# Altium schematic sheet power.SchDoc
size A4
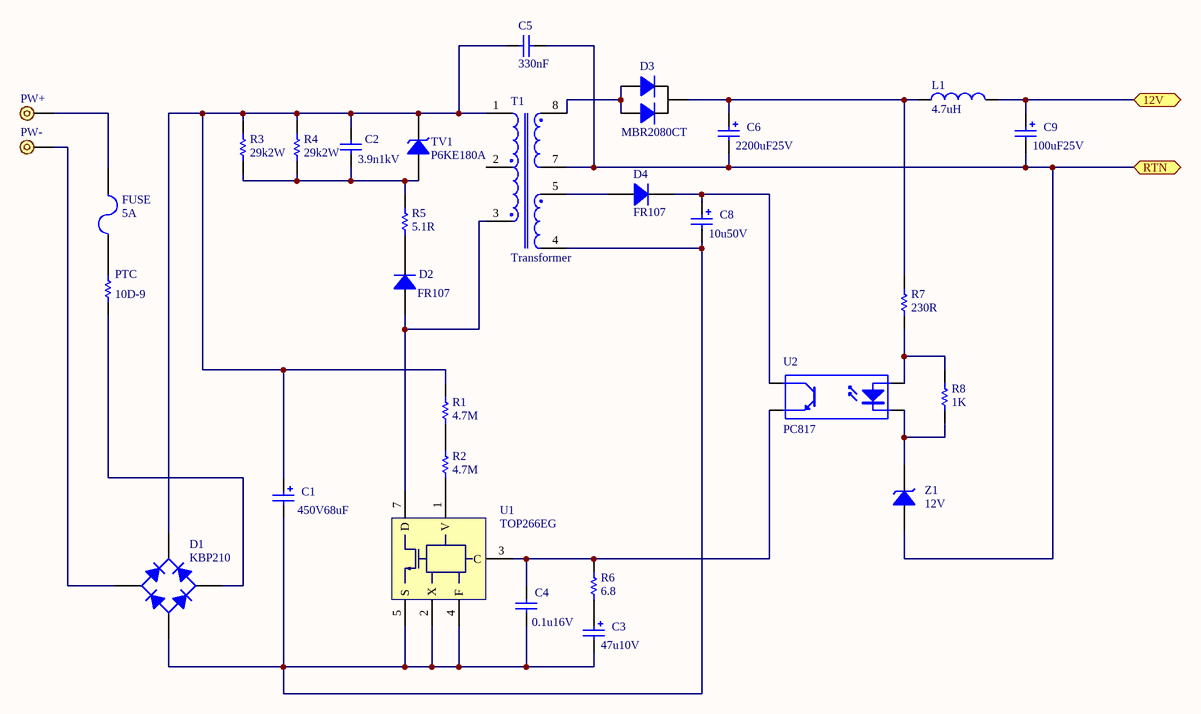
[diagram p0: power.SchDoc]

## Parts
C1  450V68uF  [CAP_18x30]
C2  3.9n1kV  [CAP7]
C3  47u10V  [CAP3]
C4  0.1u16V  [CAP6]
C5  330nF  [CAP_MKP]
C6  2200uF25V  [CAP_18x30]
C8  10u50V  [CAP3]
C9  100uF25V  [CAP3]
D1  KBP210  [KBP310]
D2  FR107  [DIO1]
D3  MBR2080CT  [TO247_TO220_SINK]
D4  FR107  [DIO1]
FUSE  5A  [FUSE5X20]
L1  4.7uH  [CHOKE]
PTC  10D-9  [PTC]
PW+  (no value)  [PAD1]
PW-  (no value)  [PAD1]
R1  4.7M  [RES0.25W]
R2  4.7M  [RES0.25W]
R3  29k2W  [RES2W_H]
R4  29k2W  [RES2W_H]
R5  5.1R  [RES0.25W]
R6  6.8  [RES0.25W]
R7  230R  [RES0.25W]
R8  1K  [RES0.25W]
T1  Transformer  [EER28]
TV1  P6KE180A  [DIO1]
U1  TOP266EG  [eSIP_SINK]
U2  PC817  [DIP-4]
Z1  12V  [DIO2]

## Ports
12V, RTN

## Nets
12V: C9.1 L1.2 ; port 12V
RTN: C5.2 C6.2 C9.2 T1.7 Z1.1(A) ; port RTN
NetC1_1: C1.1 C2.1 C5.1 D1.1(K) R1.2 R3.2 R4.2 T1.1 TV1.2(K)
NetC1_2: C1.2 C3.2 C4.2 C8.2 D1.4(A) T1.4 U1.2(X) U1.4(F) U1.5(S)
NetC2_2: C2.2 R3.1 R4.1 R5.2 TV1.1(A)
NetC3_1: C3.1 R6.1
NetC4_1: C4.1 R6.2 U1.3(C) U2.3(E)
NetC6_1: C6.1 D3.2(K) L1.1 R7.2
NetC8_1: C8.1 D4.2(K) U2.4(C)
NetD1_2: D1.2(C) PTC.2
NetD1_3: D1.3(C) PW-.1
NetD2_1: D2.1(A) T1.3 U1.7(D)
NetD2_2: D2.2(K) R5.1
NetD3_1: D3.1(A) D3.3(A) T1.8
NetD4_1: D4.1(A) T1.5
NetFUSE_1: FUSE.1 PW+.1
NetFUSE_2: FUSE.2 PTC.1
NetR1_1: R1.1 R2.2
NetR2_1: R2.1 U1.1(V)
NetR7_1: R7.1 R8.2 U2.1(A)
NetR8_1: R8.1 U2.2(K) Z1.2(K)

Not connected (* = marked no-connect by the designer): T1 2

## Library data of the parts
C1 C3 C6 C8 C9 = Cap Pol2: Polarized Capacitor (Axial); Published: 8-Jun-2000; LatestRevisionDate: 17-Jul-2002; LatestRevisionNote: Re-released for DXP Platform.; Publisher: Altium Limited
C2 C4 C5 = Cap: Capacitor; Published: 8-Jun-2000; LatestRevisionDate: 17-Jul-2002; LatestRevisionNote: Re-released for DXP Platform.; Publisher: Altium Limited
D1 = KBP310: Single Phase Rectifier Bridge; Published: 8-Jun-2000; LatestRevisionDate: 17-Jul-2002; LatestRevisionNote: Re-released for DXP Platform.; DatasheetDocument: E2753A; PackageReference: D-44; Publisher: Altium Limited; ComponentLink1Description: Manufacturer Link; ComponentLink1URL: http://www.irf.com/
D2 D4 = Diode: 1 Amp Fast Recovery Rectifier; Published: 8-Jun-2000; LatestRevisionDate: 17-Jul-2002; LatestRevisionNote: Re-released for DXP Platform.; PackageReference: DO-41; Publisher: Altium Limited; Code_JEDEC: DO-204-AL; DatasheetDocument: 1999; PackageDocument: Aug-1999; ComponentLink1Description: Manufacturer Link; ComponentLink1URL: http://www.fairchildsemi.com/
D3 = Diode2: Dual Diode TO-247; Published: 8-Jun-2000; LatestRevisionDate: 17-Jul-2002; LatestRevisionNote: Re-released for DXP Platform.; DatasheetDocument: 1999; PackageDocument: Aug-1999; PackageReference: DO-41; Publisher: Altium Limited; ComponentLink1Description: Manufacturer Link; ComponentLink1URL: http://www.fairchildsemi.com/; Code_JEDEC: DO-204-AL
FUSE = Fuse 2: Fuse; Published: 8-Jun-2000; LatestRevisionDate: 17-Jul-2002; LatestRevisionNote: Re-released for DXP Platform.; Publisher: Altium Limited
L1 = Inductor: Code_IEC: 1005; Published: 8-Jun-2000; LatestRevisionDate: 17-Jul-2002; LatestRevisionNote: Re-released for DXP Platform.; PackageReference: 0402-A; Publisher: Altium Limited; Code_JEITA: 0402
PTC R1-R8 = Res1: Resistor; Published: 8-Jun-2000; LatestRevisionDate: 17-Jul-2002; LatestRevisionNote: Re-released for DXP Platform.; Publisher: Altium Limited
PW+ PW- = Header1: Header, 1-Pin; LatestRevisionDate: 17-Jul-2002; LatestRevisionNote: Re-released for DXP Platform.; Publisher: Altium Limited
T1 = EER28: Published: 24-Mar-1999; LatestRevisionDate: 17-Jul-2002; LatestRevisionNote: Re-released for DXP Platform.; Publisher: Altium Limited
TV1 Z1 = D Zener: Zener Diode; Published: 8-Jun-2000; LatestRevisionDate: 17-Jul-2002; LatestRevisionNote: Re-released for DXP Platform.; Publisher: Altium Limited
U1 = TOP26xEG: PI TopSwitch II
U2 = Optoisolator1: 4-Pin Phototransistor Optocoupler; Published: 24-Mar-1999; LatestRevisionDate: 4-Mar-2005; LatestRevisionNote: Sch pins 3 & 4 Swapped.; DatasheetDocument: Nov-2003; PackageReference: DIP-4; Publisher: Altium Limited